# Altium schematic sheet 10nF 50V SCH.schdoc
size 43 x 29 mm
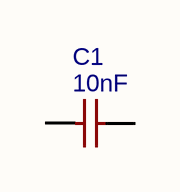
[diagram p0: 10nF 50V SCH.schdoc]

## Parts
C1  10nF  [C0603]

## Nets

Not connected (* = marked no-connect by the designer): C1 1 2

## Library data of the parts
C1 = 10nF: Manufacturer Part: CL10B103KB8NNNC; Manufacturer: SAMSUNG(三星); nameAlias: Value; Supplier: LCSC; Supplier Part: C1589; JLCPCB Part Class: Extended Part; spicePre: C; spiceSymbolName: CL10B103KB8NNNC